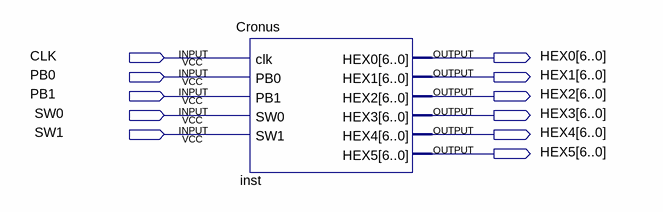
[diagram p0: schematic sheet]
// Quartus schematic Lab4.bdf as structural Verilog: 1 symbols, 11 pins
module Lab4 (
  input  CLK,
  input  PB0,
  input  PB1,
  input  SW0,
  input  SW1,
  output [6:0] HEX0,
  output [6:0] HEX1,
  output [6:0] HEX2,
  output [6:0] HEX3,
  output [6:0] HEX4,
  output [6:0] HEX5
);

  Cronus inst (
    .clk(CLK), .PB0(PB0), .PB1(PB1), .SW0(SW0), .SW1(SW1), .HEX0(HEX0), .HEX1(HEX1), .HEX2(HEX2),
    .HEX3(HEX3), .HEX4(HEX4), .HEX5(HEX5));
endmodule
